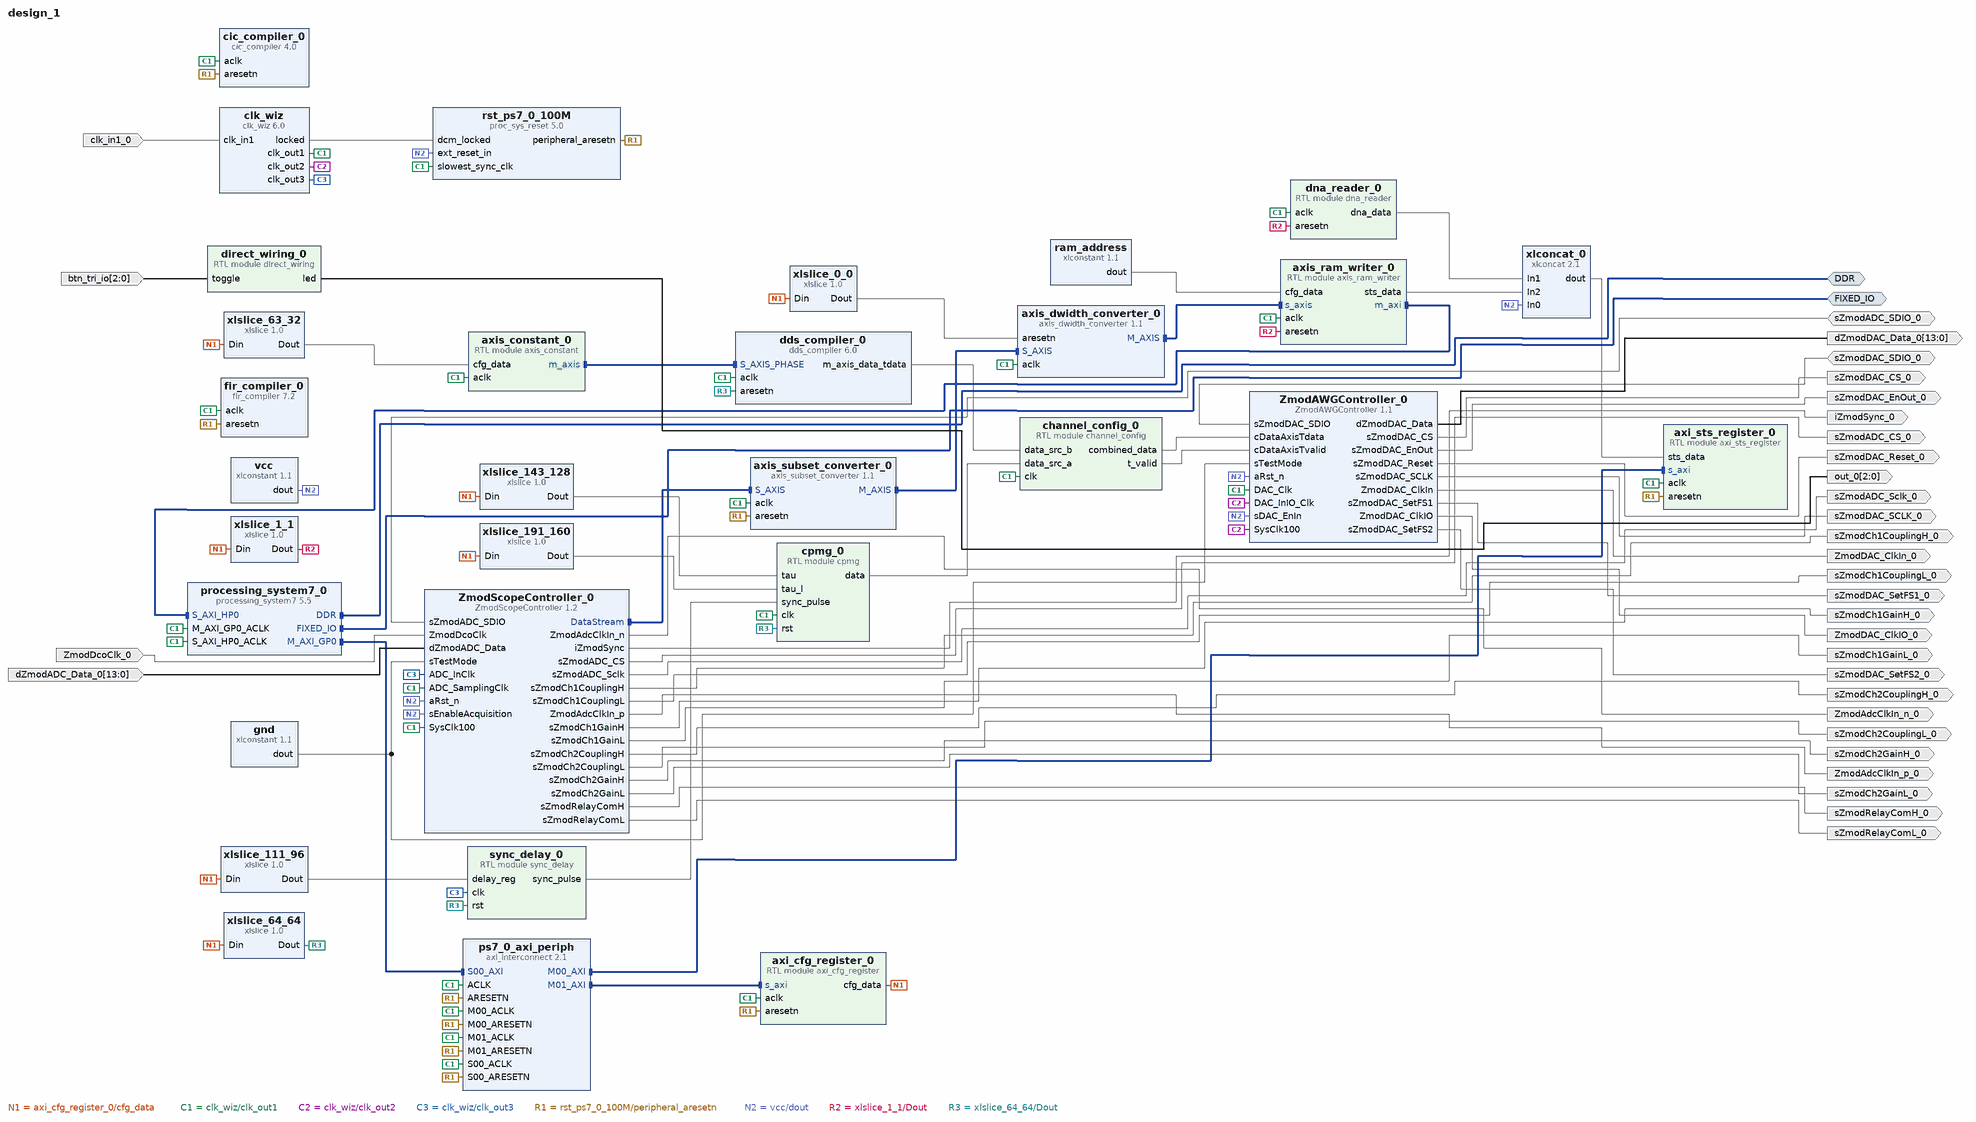
[diagram p0: block diagram of the top level]
# Vivado block design design_1, xc7z020clg484-1, Vivado 2022.2
create_bd_design design_1

create_bd_intf_port -mode Master -vlnv xilinx.com:interface:ddrx_rtl:1.0 DDR
create_bd_intf_port -mode Master -vlnv xilinx.com:display_processing_system7:fixedio_rtl:1.0 FIXED_IO
create_bd_port -dir O -from 2 -to 0 out_0
create_bd_port -dir I -from 2 -to 0 btn_tri_io
create_bd_port -dir I -type clk ZmodDcoClk_0
create_bd_port -dir I -from 13 -to 0 dZmodADC_Data_0
create_bd_port -dir O ZmodAdcClkIn_n_0
create_bd_port -dir O ZmodAdcClkIn_p_0
create_bd_port -dir O iZmodSync_0
create_bd_port -dir O sZmodRelayComH_0
create_bd_port -dir O sZmodRelayComL_0
create_bd_port -dir O sZmodCh2GainH_0
create_bd_port -dir O sZmodCh2GainL_0
create_bd_port -dir O sZmodCh2CouplingL_0
create_bd_port -dir O sZmodCh2CouplingH_0
create_bd_port -dir O sZmodCh1GainL_0
create_bd_port -dir O sZmodCh1GainH_0
create_bd_port -dir O sZmodCh1CouplingL_0
create_bd_port -dir O sZmodCh1CouplingH_0
create_bd_port -dir IO sZmodADC_SDIO_0
create_bd_port -dir O sZmodADC_Sclk_0
create_bd_port -dir O sZmodADC_CS_0
create_bd_port -dir I -type clk clk_in1_0
create_bd_port -dir O sZmodDAC_CS_0
create_bd_port -dir O sZmodDAC_EnOut_0
create_bd_port -dir O -type rst sZmodDAC_Reset_0
create_bd_port -dir O sZmodDAC_SCLK_0
create_bd_port -dir IO sZmodDAC_SDIO_0
create_bd_port -dir O sZmodDAC_SetFS1_0
create_bd_port -dir O sZmodDAC_SetFS2_0
create_bd_port -dir O -type clk ZmodDAC_ClkIn_0
create_bd_port -dir O -type clk ZmodDAC_ClkIO_0
create_bd_port -dir O -from 13 -to 0 dZmodDAC_Data_0

create_bd_cell -type ip -vlnv xilinx.com:ip:axi_interconnect:2.1 ps7_0_axi_periph
set_property -dict {CONFIG.NUM_MI 2} [get_bd_cells ps7_0_axi_periph]
create_bd_cell -type ip -vlnv xilinx.com:ip:proc_sys_reset:5.0 rst_ps7_0_100M
create_bd_cell -type module -reference direct_wiring direct_wiring_0
create_bd_cell -type ip -vlnv digilent.com:user:ZmodScopeController:1.2 ZmodScopeController_0
set_property -dict [list \
  CONFIG.kCh1GainStatic {"1"} \
  CONFIG.kCh2GainStatic {"1"} \
  CONFIG.kExtCalibEn false \
  CONFIG.kExtRelayConfigEn false \
] [get_bd_cells ZmodScopeController_0]
create_bd_cell -type ip -vlnv xilinx.com:ip:xlconstant:1.1 vcc
create_bd_cell -type ip -vlnv xilinx.com:ip:xlconstant:1.1 gnd
create_bd_cell -type ip -vlnv xilinx.com:ip:clk_wiz:6.0 clk_wiz
set_property -dict [list \
  CONFIG.CLKIN1_JITTER_PS 100.0 \
  CONFIG.CLKOUT1_JITTER 144.719 \
  CONFIG.CLKOUT1_PHASE_ERROR 114.212 \
  CONFIG.CLKOUT2_JITTER 144.719 \
  CONFIG.CLKOUT2_PHASE_ERROR 114.212 \
  CONFIG.CLKOUT2_REQUESTED_PHASE 90 \
  CONFIG.CLKOUT2_USED true \
  CONFIG.CLKOUT3_JITTER 111.164 \
  CONFIG.CLKOUT3_PHASE_ERROR 114.212 \
  CONFIG.CLKOUT3_REQUESTED_OUT_FREQ 400.000 \
  CONFIG.CLKOUT3_REQUESTED_PHASE 90.000 \
  CONFIG.CLKOUT3_USED true \
  CONFIG.MMCM_CLKFBOUT_MULT_F 8.000 \
  CONFIG.MMCM_CLKIN1_PERIOD 10.000 \
  CONFIG.MMCM_CLKOUT0_DIVIDE_F 8.000 \
  CONFIG.MMCM_CLKOUT1_DIVIDE 8 \
  CONFIG.MMCM_CLKOUT1_PHASE 90.000 \
  CONFIG.MMCM_CLKOUT2_DIVIDE 2 \
  CONFIG.MMCM_CLKOUT2_PHASE 90.000 \
  CONFIG.MMCM_DIVCLK_DIVIDE 1 \
  CONFIG.NUM_OUT_CLKS 3 \
  CONFIG.PRIM_IN_FREQ 100 \
  CONFIG.USE_RESET false \
] [get_bd_cells clk_wiz]
create_bd_cell -type ip -vlnv xilinx.com:ip:axis_subset_converter:1.1 axis_subset_converter_0
set_property -dict [list \
  CONFIG.M_TDATA_NUM_BYTES 2 \
  CONFIG.S_TDATA_NUM_BYTES 4 \
  CONFIG.TDATA_REMAP {tdata[15:0]} \
] [get_bd_cells axis_subset_converter_0]
create_bd_cell -type ip -vlnv xilinx.com:ip:cic_compiler:4.0 cic_compiler_0
set_property -dict [list \
  CONFIG.Clock_Frequency 100.0 \
  CONFIG.Filter_Type Decimation \
  CONFIG.Fixed_Or_Initial_Rate 10 \
  CONFIG.HAS_ARESETN true \
  CONFIG.Input_Data_Width 16 \
  CONFIG.Input_Sample_Frequency 100 \
  CONFIG.Maximum_Rate 10 \
  CONFIG.Minimum_Rate 10 \
  CONFIG.Number_Of_Stages 4 \
  CONFIG.Output_Data_Width 16 \
  CONFIG.Quantization Truncation \
  CONFIG.SamplePeriod 1 \
] [get_bd_cells cic_compiler_0]
create_bd_cell -type ip -vlnv xilinx.com:ip:fir_compiler:7.2 fir_compiler_0
set_property -dict [list \
  CONFIG.BestPrecision true \
  CONFIG.Clock_Frequency 100.0 \
  CONFIG.CoefficientVector {['0.0014741954966090763, 0.0014911653845916045, 0.0015415339178727347, 0.0016251187401673615, 0.001741605649488668, 0.001890549804587908, 0.002071377451290726, 0.0022833881620101686,', '0.002525757579667078, 0.002797540655233539, 0.0030976753661425536, 0.003424986900885117, 0.0037781922932518725, 0.004155905487878263, 0.004556642817026605, 0.004978828866892743, 0.005420802710165686,', '0.0058808244801017, 0.006357082260006297, 0.006847699260753156, 0.007350741257814013, 0.007864224258232135, 0.008386122367048481, 0.008914375821887949, 0.009446899163736144, 0.009981589511387778,', '0.010516334906628486, 0.011049022696923747, 0.01157754792223358, 0.012099821672549802, 0.012613779382864173, 0.013117389032520606, 0.013608659216281297, 0.014085647054943959, 0.014546465913983337,', '0.014989292899452182, 0.015412376101261826, 0.015814041554967004, 0.016192699894299622, 0.016546852667927017, 0.016875098295247547, 0.01717613763747395, 0.017448779161787983, 0.017691943677971445,', '0.017904668628622843, 0.018086111915848746, 0.01823555524916691, 0.018352407001267643, 0.018436204560242482, 0.01848661616889746, 0.018503442243814255, 0.01848661616889746, 0.018436204560242482,', '0.018352407001267643, 0.018235555249166906, 0.018086111915848743, 0.01790466862862284, 0.017691943677971445, 0.017448779161787983, 0.01717613763747395, 0.016875098295247547, 0.016546852667927013,', '0.01619269989429962, 0.015814041554967004, 0.015412376101261826, 0.014989292899452182, 0.014546465913983333, 0.014085647054943957, 0.013608659216281292, 0.013117389032520603, 0.012613779382864171,', '0.012099821672549799, 0.011577547922233578, 0.011049022696923736, 0.010516334906628481, 0.009981589511387777, 0.00944689916373614, 0.008914375821887949, 0.008386122367048474, 0.007864224258232131,', '0.007350741257814013, 0.006847699260753151, 0.006357082260006297, 0.005880824480101694, 0.005420802710165682, 0.004978828866892736, 0.0045566428170266, 0.004155905487878263, 0.0037781922932518678,', '0.003424986900885115, 0.0030976753661425497, 0.002797540655233536, 0.002525757579667078, 0.0022833881620101647, 0.0020713774512907237, 0.001890549804587907, 0.0017416056494886669,', '0.0016251187401673615, 0.0015415339178727334, 0.0014911653845916045, 0.0014741954966090763']} \
  CONFIG.Coefficient_Fractional_Bits 21 \
  CONFIG.Coefficient_Sets 1 \
  CONFIG.Coefficient_Sign Unsigned \
  CONFIG.Coefficient_Structure Inferred \
  CONFIG.Coefficient_Width 16 \
  CONFIG.ColumnConfig 6 \
  CONFIG.Data_Fractional_Bits 0 \
  CONFIG.Decimation_Rate 10 \
  CONFIG.Filter_Architecture Systolic_Multiply_Accumulate \
  CONFIG.Filter_Type Decimation \
  CONFIG.Has_ARESETn true \
  CONFIG.Interpolation_Rate 1 \
  CONFIG.Number_Channels 1 \
  CONFIG.Output_Rounding_Mode Convergent_Rounding_to_Even \
  CONFIG.Output_Width 16 \
  CONFIG.Quantization Quantize_Only \
  CONFIG.RateSpecification Frequency_Specification \
  CONFIG.Sample_Frequency 100 \
  CONFIG.Zero_Pack_Factor 1 \
] [get_bd_cells fir_compiler_0]
create_bd_cell -type ip -vlnv xilinx.com:ip:axis_dwidth_converter:1.1 axis_dwidth_converter_0
set_property -dict {CONFIG.M_TDATA_NUM_BYTES 8 CONFIG.S_TDATA_NUM_BYTES 2} [get_bd_cells axis_dwidth_converter_0]
create_bd_cell -type module -reference axis_ram_writer axis_ram_writer_0
set_property -dict {CONFIG.ADDR_WIDTH 16} [get_bd_cells axis_ram_writer_0]
create_bd_cell -type ip -vlnv xilinx.com:ip:xlconstant:1.1 ram_address
set_property -dict {CONFIG.CONST_VAL 503316480 CONFIG.CONST_WIDTH 32} [get_bd_cells ram_address]
create_bd_cell -type ip -vlnv xilinx.com:ip:xlconcat:2.1 xlconcat_0
set_property -dict {CONFIG.IN0_WIDTH 32 CONFIG.IN1_WIDTH 64 CONFIG.IN2_WIDTH 32 CONFIG.NUM_PORTS 3} [get_bd_cells xlconcat_0]
create_bd_cell -type module -reference dna_reader dna_reader_0
create_bd_cell -type module -reference axi_sts_register axi_sts_register_0
set_property -dict {CONFIG.AXI_ADDR_WIDTH 32 CONFIG.STS_DATA_WIDTH 128} [get_bd_cells axi_sts_register_0]
create_bd_cell -type module -reference axi_cfg_register axi_cfg_register_0
set_property -dict {CONFIG.AXI_ADDR_WIDTH 32 CONFIG.CFG_DATA_WIDTH 256} [get_bd_cells axi_cfg_register_0]
create_bd_cell -type ip -vlnv xilinx.com:ip:xlslice:1.0 xlslice_0_0
set_property -dict {CONFIG.DIN_WIDTH 256} [get_bd_cells xlslice_0_0]
create_bd_cell -type ip -vlnv xilinx.com:ip:xlslice:1.0 xlslice_1_1
set_property -dict {CONFIG.DIN_FROM 1 CONFIG.DIN_TO 1 CONFIG.DIN_WIDTH 256} [get_bd_cells xlslice_1_1]
create_bd_cell -type ip -vlnv xilinx.com:ip:xlslice:1.0 xlslice_143_128
set_property -dict {CONFIG.DIN_FROM 143 CONFIG.DIN_TO 128 CONFIG.DIN_WIDTH 256} [get_bd_cells xlslice_143_128]
create_bd_cell -type ip -vlnv xilinx.com:ip:xlslice:1.0 xlslice_191_160
set_property -dict {CONFIG.DIN_FROM 191 CONFIG.DIN_TO 160 CONFIG.DIN_WIDTH 256} [get_bd_cells xlslice_191_160]
create_bd_cell -type ip -vlnv xilinx.com:ip:xlslice:1.0 xlslice_64_64
set_property -dict {CONFIG.DIN_FROM 64 CONFIG.DIN_TO 64 CONFIG.DIN_WIDTH 256} [get_bd_cells xlslice_64_64]
create_bd_cell -type ip -vlnv xilinx.com:ip:xlslice:1.0 xlslice_111_96
set_property -dict {CONFIG.DIN_FROM 111 CONFIG.DIN_TO 96 CONFIG.DIN_WIDTH 256} [get_bd_cells xlslice_111_96]
create_bd_cell -type ip -vlnv xilinx.com:ip:xlslice:1.0 xlslice_63_32
set_property -dict {CONFIG.DIN_FROM 63 CONFIG.DIN_TO 32 CONFIG.DIN_WIDTH 256} [get_bd_cells xlslice_63_32]
create_bd_cell -type module -reference axis_constant axis_constant_0
create_bd_cell -type ip -vlnv xilinx.com:ip:dds_compiler:6.0 dds_compiler_0
set_property -dict [list \
  CONFIG.DATA_Has_TLAST Not_Required \
  CONFIG.Has_ARESETn true \
  CONFIG.Latency 7 \
  CONFIG.Noise_Shaping None \
  CONFIG.Output_Frequency1 0 \
  CONFIG.Output_Selection Sine \
  CONFIG.Output_Width 16 \
  CONFIG.PINC1 0 \
  CONFIG.Parameter_Entry Hardware_Parameters \
  CONFIG.Phase_Increment Streaming \
  CONFIG.Phase_Width 32 \
  CONFIG.S_PHASE_Has_TUSER Not_Required \
] [get_bd_cells dds_compiler_0]
create_bd_cell -type module -reference cpmg cpmg_0
create_bd_cell -type module -reference sync_delay sync_delay_0
create_bd_cell -type module -reference channel_config channel_config_0
create_bd_cell -type ip -vlnv digilent.com:user:ZmodAWGController:1.1 ZmodAWGController_0
create_bd_cell -type ip -vlnv xilinx.com:ip:processing_system7:5.5 processing_system7_0
set_property -dict [list \
  CONFIG.PCW_ENET0_ENET0_IO {MIO 16 .. 27} \
  CONFIG.PCW_ENET0_GRP_MDIO_ENABLE 1 \
  CONFIG.PCW_ENET0_GRP_MDIO_IO {MIO 52 .. 53} \
  CONFIG.PCW_ENET0_PERIPHERAL_ENABLE 1 \
  CONFIG.PCW_ENET0_RESET_ENABLE 1 \
  CONFIG.PCW_ENET0_RESET_IO {MIO 9} \
  CONFIG.PCW_ENET_RESET_ENABLE 1 \
  CONFIG.PCW_ENET_RESET_SELECT {Share reset pin} \
  CONFIG.PCW_FPGA0_PERIPHERAL_FREQMHZ 100 \
  CONFIG.PCW_GPIO_MIO_GPIO_ENABLE 1 \
  CONFIG.PCW_GPIO_MIO_GPIO_IO MIO \
  CONFIG.PCW_I2C1_I2C1_IO {MIO 12 .. 13} \
  CONFIG.PCW_I2C1_PERIPHERAL_ENABLE 1 \
  CONFIG.PCW_I2C_PERIPHERAL_FREQMHZ 111.111115 \
  CONFIG.PCW_I2C_RESET_ENABLE 1 \
  CONFIG.PCW_I2C_RESET_SELECT {Share reset pin} \
  CONFIG.PCW_PRESET_BANK1_VOLTAGE {LVCMOS 1.8V} \
  CONFIG.PCW_QSPI_PERIPHERAL_ENABLE 0 \
  CONFIG.PCW_SD0_PERIPHERAL_ENABLE 0 \
  CONFIG.PCW_UART0_PERIPHERAL_ENABLE 1 \
  CONFIG.PCW_UART0_UART0_IO {MIO 14 .. 15} \
  CONFIG.PCW_UART_PERIPHERAL_FREQMHZ 100 \
  CONFIG.PCW_UIPARAM_DDR_PARTNO {MT41K256M16 RE-125} \
  CONFIG.PCW_USB0_PERIPHERAL_ENABLE 1 \
  CONFIG.PCW_USB0_RESET_ENABLE 1 \
  CONFIG.PCW_USB0_RESET_IO {MIO 46} \
  CONFIG.PCW_USB0_USB0_IO {MIO 28 .. 39} \
  CONFIG.PCW_USB_RESET_ENABLE 1 \
  CONFIG.PCW_USB_RESET_SELECT {Share reset pin} \
  CONFIG.PCW_USE_S_AXI_HP0 1 \
] [get_bd_cells processing_system7_0]
# 261 more settings of processing_system7_0 are not shown: defaults, MIO pin electricals, DDR timing, and values the tool derives

# ---- connections ----

connect_bd_intf_net [get_bd_intf_pins ps7_0_axi_periph/S00_AXI] [get_bd_intf_pins processing_system7_0/M_AXI_GP0]
connect_bd_intf_net [get_bd_intf_pins axis_subset_converter_0/S_AXIS] [get_bd_intf_pins ZmodScopeController_0/DataStream]
connect_bd_intf_net [get_bd_intf_pins axis_constant_0/m_axis] [get_bd_intf_pins dds_compiler_0/S_AXIS_PHASE]
connect_bd_intf_net [get_bd_intf_pins axis_dwidth_converter_0/M_AXIS] [get_bd_intf_pins axis_ram_writer_0/s_axis]
connect_bd_intf_net [get_bd_intf_pins axis_ram_writer_0/m_axi] [get_bd_intf_pins processing_system7_0/S_AXI_HP0]
connect_bd_intf_net [get_bd_intf_pins axis_subset_converter_0/M_AXIS] [get_bd_intf_pins axis_dwidth_converter_0/S_AXIS]
connect_bd_intf_net -intf_net processing_system7_1_DDR [get_bd_intf_ports DDR] [get_bd_intf_pins processing_system7_0/DDR]
connect_bd_intf_net -intf_net processing_system7_1_FIXED_IO [get_bd_intf_ports FIXED_IO] [get_bd_intf_pins processing_system7_0/FIXED_IO]
connect_bd_intf_net [get_bd_intf_pins ps7_0_axi_periph/M00_AXI] [get_bd_intf_pins axi_sts_register_0/s_axi]
connect_bd_intf_net [get_bd_intf_pins ps7_0_axi_periph/M01_AXI] [get_bd_intf_pins axi_cfg_register_0/s_axi]
connect_bd_net [get_bd_ports sZmodADC_SDIO_0] [get_bd_pins ZmodScopeController_0/sZmodADC_SDIO]
connect_bd_net [get_bd_ports sZmodDAC_SDIO_0] [get_bd_pins ZmodAWGController_0/sZmodDAC_SDIO]
connect_bd_net [get_bd_pins ZmodAWGController_0/ZmodDAC_ClkIO] [get_bd_ports ZmodDAC_ClkIO_0]
connect_bd_net [get_bd_pins ZmodAWGController_0/ZmodDAC_ClkIn] [get_bd_ports ZmodDAC_ClkIn_0]
connect_bd_net [get_bd_pins ZmodAWGController_0/dZmodDAC_Data] [get_bd_ports dZmodDAC_Data_0]
connect_bd_net [get_bd_pins ZmodAWGController_0/sZmodDAC_CS] [get_bd_ports sZmodDAC_CS_0]
connect_bd_net [get_bd_pins ZmodAWGController_0/sZmodDAC_EnOut] [get_bd_ports sZmodDAC_EnOut_0]
connect_bd_net [get_bd_pins ZmodAWGController_0/sZmodDAC_Reset] [get_bd_ports sZmodDAC_Reset_0]
connect_bd_net [get_bd_pins ZmodAWGController_0/sZmodDAC_SCLK] [get_bd_ports sZmodDAC_SCLK_0]
connect_bd_net [get_bd_pins ZmodAWGController_0/sZmodDAC_SetFS1] [get_bd_ports sZmodDAC_SetFS1_0]
connect_bd_net [get_bd_pins ZmodAWGController_0/sZmodDAC_SetFS2] [get_bd_ports sZmodDAC_SetFS2_0]
connect_bd_net -net ZmodDcoClk_0_1 [get_bd_ports ZmodDcoClk_0] [get_bd_pins ZmodScopeController_0/ZmodDcoClk]
connect_bd_net [get_bd_pins ZmodScopeController_0/ZmodAdcClkIn_n] [get_bd_ports ZmodAdcClkIn_n_0]
connect_bd_net [get_bd_pins ZmodScopeController_0/ZmodAdcClkIn_p] [get_bd_ports ZmodAdcClkIn_p_0]
connect_bd_net [get_bd_pins ZmodScopeController_0/iZmodSync] [get_bd_ports iZmodSync_0]
connect_bd_net [get_bd_pins ZmodScopeController_0/sZmodADC_CS] [get_bd_ports sZmodADC_CS_0]
connect_bd_net [get_bd_pins ZmodScopeController_0/sZmodADC_Sclk] [get_bd_ports sZmodADC_Sclk_0]
connect_bd_net [get_bd_pins ZmodScopeController_0/sZmodCh1CouplingH] [get_bd_ports sZmodCh1CouplingH_0]
connect_bd_net [get_bd_pins ZmodScopeController_0/sZmodCh1CouplingL] [get_bd_ports sZmodCh1CouplingL_0]
connect_bd_net [get_bd_pins ZmodScopeController_0/sZmodCh1GainH] [get_bd_ports sZmodCh1GainH_0]
connect_bd_net [get_bd_pins ZmodScopeController_0/sZmodCh1GainL] [get_bd_ports sZmodCh1GainL_0]
connect_bd_net [get_bd_pins ZmodScopeController_0/sZmodCh2CouplingH] [get_bd_ports sZmodCh2CouplingH_0]
connect_bd_net [get_bd_pins ZmodScopeController_0/sZmodCh2CouplingL] [get_bd_ports sZmodCh2CouplingL_0]
connect_bd_net [get_bd_pins ZmodScopeController_0/sZmodCh2GainH] [get_bd_ports sZmodCh2GainH_0]
connect_bd_net [get_bd_pins ZmodScopeController_0/sZmodCh2GainL] [get_bd_ports sZmodCh2GainL_0]
connect_bd_net [get_bd_pins ZmodScopeController_0/sZmodRelayComH] [get_bd_ports sZmodRelayComH_0]
connect_bd_net [get_bd_pins ZmodScopeController_0/sZmodRelayComL] [get_bd_ports sZmodRelayComL_0]
connect_bd_net [get_bd_pins axi_cfg_register_0/cfg_data] \
  [get_bd_pins xlslice_0_0/Din] [get_bd_pins xlslice_1_1/Din] [get_bd_pins xlslice_143_128/Din] \
  [get_bd_pins xlslice_191_160/Din] [get_bd_pins xlslice_64_64/Din] [get_bd_pins xlslice_111_96/Din] \
  [get_bd_pins xlslice_63_32/Din]
connect_bd_net [get_bd_pins axis_ram_writer_0/sts_data] [get_bd_pins xlconcat_0/In2]
connect_bd_net [get_bd_pins channel_config_0/combined_data] [get_bd_pins ZmodAWGController_0/cDataAxisTdata]
connect_bd_net [get_bd_pins channel_config_0/t_valid] [get_bd_pins ZmodAWGController_0/cDataAxisTvalid]
connect_bd_net -net clk_in1_0_1 [get_bd_ports clk_in1_0] [get_bd_pins clk_wiz/clk_in1]
connect_bd_net [get_bd_pins clk_wiz/clk_out1] \
  [get_bd_pins ZmodScopeController_0/SysClk100] [get_bd_pins ZmodScopeController_0/ADC_SamplingClk] \
  [get_bd_pins rst_ps7_0_100M/slowest_sync_clk] [get_bd_pins axis_subset_converter_0/aclk] [get_bd_pins cic_compiler_0/aclk] \
  [get_bd_pins fir_compiler_0/aclk] [get_bd_pins axis_dwidth_converter_0/aclk] [get_bd_pins axis_ram_writer_0/aclk] \
  [get_bd_pins dna_reader_0/aclk] [get_bd_pins ps7_0_axi_periph/ACLK] [get_bd_pins ps7_0_axi_periph/S00_ACLK] \
  [get_bd_pins ps7_0_axi_periph/M01_ACLK] [get_bd_pins ps7_0_axi_periph/M00_ACLK] [get_bd_pins axi_sts_register_0/aclk] \
  [get_bd_pins axi_cfg_register_0/aclk] [get_bd_pins axis_constant_0/aclk] [get_bd_pins dds_compiler_0/aclk] \
  [get_bd_pins cpmg_0/clk] [get_bd_pins channel_config_0/clk] [get_bd_pins ZmodAWGController_0/DAC_Clk] \
  [get_bd_pins processing_system7_0/M_AXI_GP0_ACLK] [get_bd_pins processing_system7_0/S_AXI_HP0_ACLK]
connect_bd_net [get_bd_pins clk_wiz/clk_out2] [get_bd_pins ZmodAWGController_0/SysClk100] [get_bd_pins ZmodAWGController_0/DAC_InIO_Clk]
connect_bd_net [get_bd_pins clk_wiz/clk_out3] [get_bd_pins ZmodScopeController_0/ADC_InClk] [get_bd_pins sync_delay_0/clk]
connect_bd_net [get_bd_pins clk_wiz/locked] [get_bd_pins rst_ps7_0_100M/dcm_locked]
connect_bd_net [get_bd_pins cpmg_0/data] [get_bd_pins channel_config_0/data_src_a]
connect_bd_net -net dZmodADC_Data_0_1 [get_bd_ports dZmodADC_Data_0] [get_bd_pins ZmodScopeController_0/dZmodADC_Data]
connect_bd_net [get_bd_pins dds_compiler_0/m_axis_data_tdata] [get_bd_pins channel_config_0/data_src_b]
connect_bd_net -net direct_wiring_0_out [get_bd_pins direct_wiring_0/led] [get_bd_ports out_0]
connect_bd_net [get_bd_pins dna_reader_0/dna_data] [get_bd_pins xlconcat_0/In1]
connect_bd_net [get_bd_pins gnd/dout] [get_bd_pins ZmodScopeController_0/sTestMode] [get_bd_pins ZmodAWGController_0/sTestMode]
connect_bd_net [get_bd_pins rst_ps7_0_100M/peripheral_aresetn] \
  [get_bd_pins ps7_0_axi_periph/S00_ARESETN] [get_bd_pins ps7_0_axi_periph/M00_ARESETN] \
  [get_bd_pins ps7_0_axi_periph/ARESETN] [get_bd_pins axis_subset_converter_0/aresetn] [get_bd_pins cic_compiler_0/aresetn] \
  [get_bd_pins fir_compiler_0/aresetn] [get_bd_pins ps7_0_axi_periph/M01_ARESETN] [get_bd_pins axi_sts_register_0/aresetn] \
  [get_bd_pins axi_cfg_register_0/aresetn]
connect_bd_net [get_bd_pins sync_delay_0/sync_pulse] [get_bd_pins cpmg_0/sync_pulse]
connect_bd_net -net toggle_0_1 [get_bd_ports btn_tri_io] [get_bd_pins direct_wiring_0/toggle]
connect_bd_net [get_bd_pins vcc/dout] \
  [get_bd_pins ZmodScopeController_0/aRst_n] [get_bd_pins ZmodScopeController_0/sEnableAcquisition] \
  [get_bd_pins rst_ps7_0_100M/ext_reset_in] [get_bd_pins xlconcat_0/In0] [get_bd_pins ZmodAWGController_0/aRst_n] \
  [get_bd_pins ZmodAWGController_0/sDAC_EnIn]
connect_bd_net [get_bd_pins xlconcat_0/dout] [get_bd_pins axi_sts_register_0/sts_data]
connect_bd_net -net xlconstant_0_dout [get_bd_pins ram_address/dout] [get_bd_pins axis_ram_writer_0/cfg_data]
connect_bd_net [get_bd_pins xlslice_0_0/Dout] [get_bd_pins axis_dwidth_converter_0/aresetn]
connect_bd_net [get_bd_pins xlslice_111_96/Dout] [get_bd_pins sync_delay_0/delay_reg]
connect_bd_net [get_bd_pins xlslice_143_128/Dout] [get_bd_pins cpmg_0/tau]
connect_bd_net [get_bd_pins xlslice_191_160/Dout] [get_bd_pins cpmg_0/tau_l]
connect_bd_net [get_bd_pins xlslice_1_1/Dout] [get_bd_pins axis_ram_writer_0/aresetn] [get_bd_pins dna_reader_0/aresetn]
connect_bd_net [get_bd_pins xlslice_63_32/Dout] [get_bd_pins axis_constant_0/cfg_data]
connect_bd_net [get_bd_pins xlslice_64_64/Dout] [get_bd_pins dds_compiler_0/aresetn] [get_bd_pins cpmg_0/rst] [get_bd_pins sync_delay_0/rst]

# ---- address map ----
assign_bd_address -offset 0x00000000 -range 512M -target_address_space [get_bd_addr_spaces axis_ram_writer_0/m_axi] [get_bd_addr_segs processing_system7_0/S_AXI_HP0/HP0_DDR_LOWOCM]
assign_bd_address -offset 0x40000000 -range 4K -target_address_space [get_bd_addr_spaces processing_system7_0/Data] [get_bd_addr_segs axi_cfg_register_0/s_axi/reg0]
assign_bd_address -offset 0x40001000 -range 4K -target_address_space [get_bd_addr_spaces processing_system7_0/Data] [get_bd_addr_segs axi_sts_register_0/s_axi/reg0]

validate_bd_design
save_bd_design
